# EAGLE design v1 (EAGLE 7.2.0)
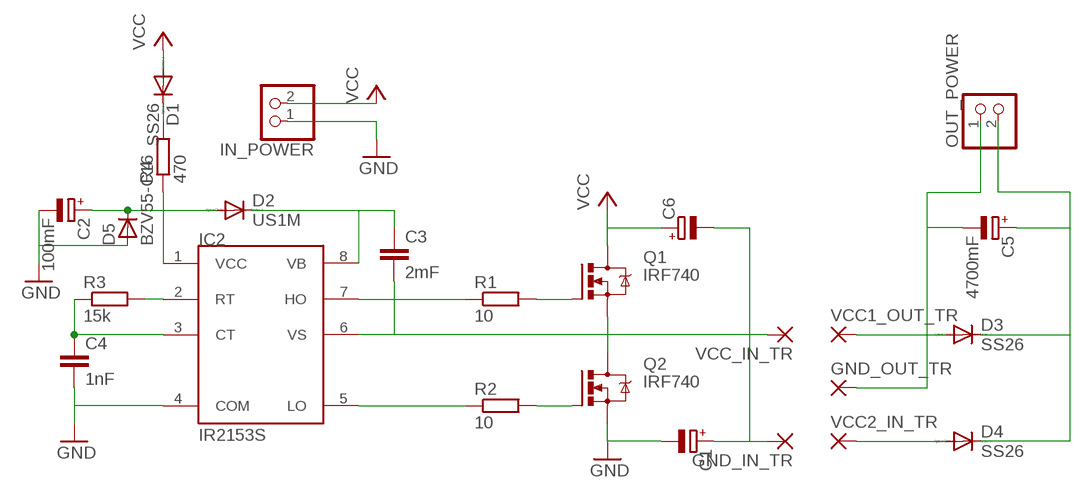
[diagram p0: schematic, sheet 1]

## Parts
C1  CPOL-EUE10-22.5  [EB22,5D]
C2  100mF  CPOL-EUC  [PANASONIC_C]
C3  2mF  C-EUC0805  [C0805]
C4  1nF  C-EUC0805  [C0805]
C5  4700mF  CPOL-EUE7.5-18  [E7,5-18]
C6  CPOL-EUE10-22.5  [EB22,5D]
D1  SS26  DIODE-DO-214AC  [DO-214AC]
D2  US1M  DIODE-DO-214AC  [DO-214AC]
D3  SS26  DIODE-DO-214AC  [DO-214AC]
D4  SS26  DIODE-DO-214AC  [DO-214AC]
D5  BZV55-C16  D-SOD-80  [SOD80]
GND_IN_TR  1,6/0,8  [1,6/0,8]
GND_OUT_TR  1,6/0,8  [1,6/0,8]
IC2  IR2153S  [SO08]
IN_POWER  PINHD-1X2  [1X02]
OUT_POWER  PINHD-1X2  [1X02]
Q1  IRF740  [TO220BV]
Q2  IRF740  [TO220BV]
R1  10  R-EU_R0805  [R0805]
R2  10  R-EU_R0805  [R0805]
R3  15k  R-EU_R0805  [R0805]
R4  470  R-EU_R0805  [R0805]
VCC1_OUT_TR  1,6/0,8  [1,6/0,8]
VCC2_IN_TR  1,6/0,8  [1,6/0,8]
VCC_IN_TR  1,6/0,8  [1,6/0,8]

## Nets
GND: C1.- C2.- C4.2 D5.2(A) IC2.4(COM) IN_POWER.1 Q2.S
N$1: IC2.7(HO) R1.1
N$2: IC2.5(LO) R2.1
N$3: C1.+ C6.- GND_IN_TR.1(P)
N$4: Q1.G R1.2
N$5: Q2.G R2.2
N$6: D3.A VCC1_OUT_TR.1(P)
N$7: IC2.2(RT) R3.2
N$8: C4.1 IC2.3(CT) R3.1
N$9: D4.A VCC2_IN_TR.1(P)
N$10: C5.- GND_OUT_TR.1(P) OUT_POWER.1
N$11: C5.+ D3.C D4.C OUT_POWER.2
N$12: D1.C R4.2
VB: C3.1 D2.C IC2.8(VB)
VCC: C6.+ D1.A IN_POWER.2 Q1.D
VCC_IR: C2.+ D2.A D5.1(C) IC2.1(VCC) R4.1
VS: C3.2 IC2.6(VS) Q1.S Q2.D VCC_IN_TR.1(P)

## Library data of the parts
C1 C2 C5 C6 = rcl:CPOL-EU: POLARIZED CAPACITOR, European symbol
C3 C4 = rcl:C-EU: CAPACITOR, European symbol
D1-D4 = diode:DIODE-: DIODE
D5 = semicon-smd-ipc:D-: DIODE unfilled
GND_IN_TR GND_OUT_TR VCC1_OUT_TR VCC2_IN_TR VCC_IN_TR = wirepad:1,6/0,8: THROUGH-HOLE PAD
IC2 = irs:IR2153
IN_POWER OUT_POWER = pinhead:PINHD-1X2: PIN HEADER
Q1 Q2 = transistor-power:IRF740: N-CHANNEL MOS FET
R1-R4 = rcl:R-EU_: RESISTOR, European symbol

## Board
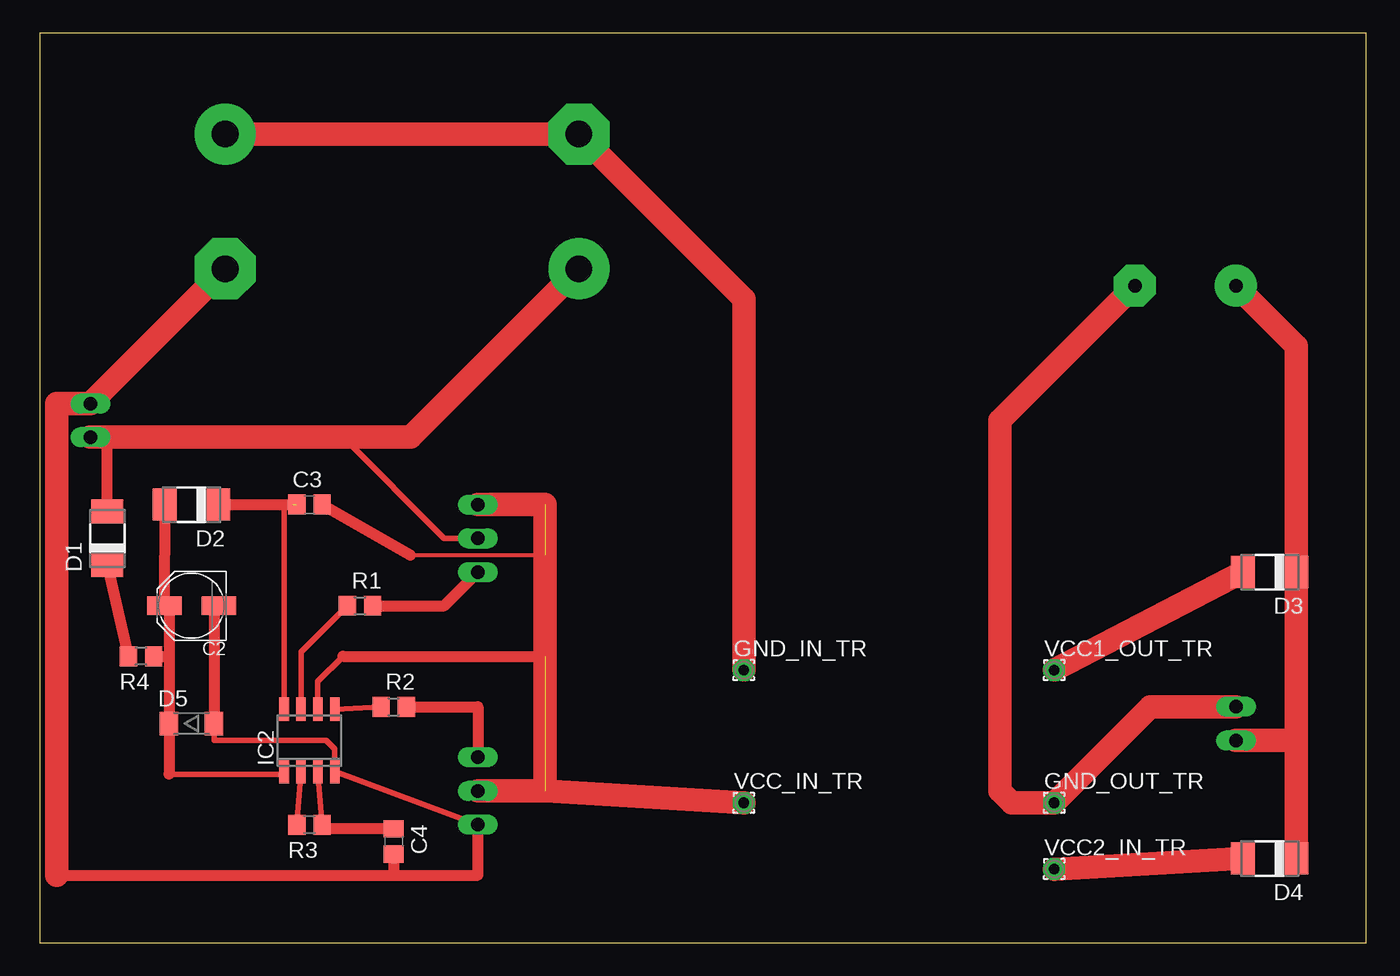
[diagram p1: board, top side]
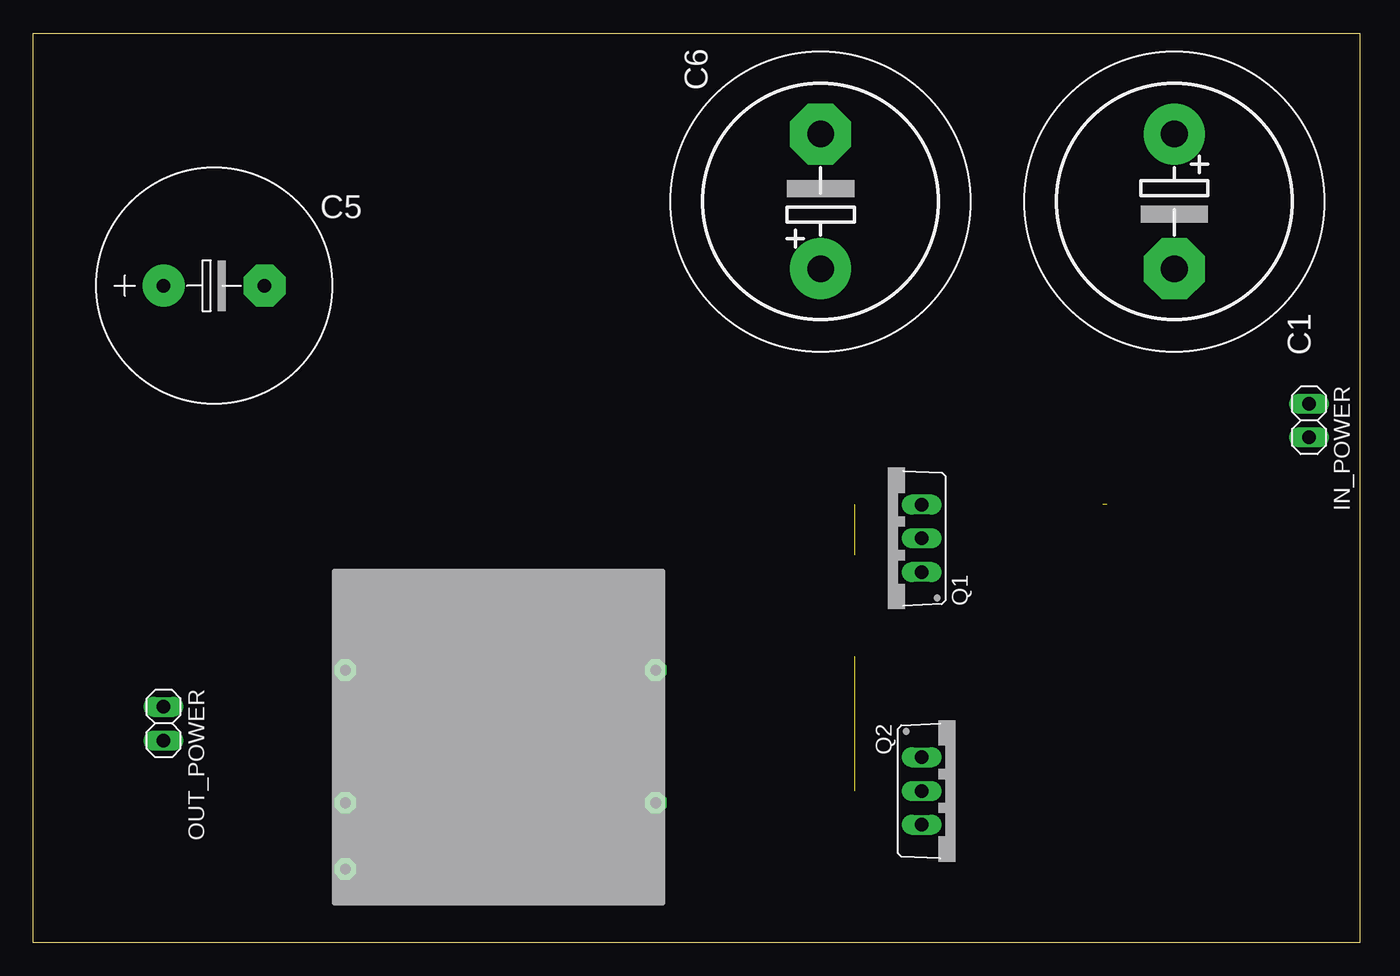
[diagram p2: board, bottom side, seen from below]

Size 100 x 68.57 mm. Coordinates in mm from the lower left corner, seen from the top.
Outline: 0,0 100,0 100,68.57 0,68.57 0,0
Copper layers (1*16): Top 0.035mm / dielectric 1.5mm / Bottom 0.035mm
Design rules "default": minimum track width 10mil, minimum drill 24mil, track to track 8mil, track to pad 8mil, pad to pad 8mil, via to via 8mil, smd to smd 8mil, copper to edge 40mil, drill to drill 8mil, minimum pad ring 10mil, minimum via ring 8mil, stop-mask expansion 4mil, vias tented up to drill 0mil, thermal gap 10mil

### Footprints (pad centres in the part's own frame; a part is rotated, then mirrored left to right if it is on the bottom)
EB22,5D = drill 2.007 pad 4.597: + -5.08,0 | drill 2.007 pad 4.597 octagon: - 5.08,0
PANASONIC_C = smd 2.6 x 1.4: + 2.05,0; - -2.05,0
C0805 = smd 1.3 x 1.5: 1 -0.95,0; 2 0.95,0
E7,5-18 = drill 1.016 pad 3.15: + -3.81,0 | drill 1.016 pad 3.15 octagon: - 3.81,0
DO-214AC = smd 1.8 x 2.4: A 2.025,0; C -2.025,0
SOD80 = smd 1.4 x 1.8: 1 -1.7,0; 2 1.7,0
1,6/0,8 = drill 0.813 pad 1.6 octagon: 1 0,0
SO08 = smd 0.72 x 1.78: 1 -1.905,-2.35; 2 -0.635,-2.35; 3 0.635,-2.35; 4 1.905,-2.35; 5 1.905,2.35; 6 0.635,2.35; 7 -0.635,2.35; 8 -1.905,2.35
1X02 = drill 1.016 long: 1 -1.27,0; 2 1.27,0
TO220BV = drill 1.016 long: D 0,-2.54; G -2.54,-2.54; S 2.54,-2.54
R0805 = smd 1.3 x 1.5: 1 -0.95,0; 2 0.95,0

### Placement (x,y rotation side)
C1  13.97,55.88 270 bottom
C2  11.43,25.4 180 top
C3  20.32,33.02 0 top
C4  26.67,7.62 270 top
C5  86.36,49.53 0 bottom
C6  40.64,55.88 90 bottom
D1  5.08,30.48 90 top
D2  11.43,33.02 180 top
D3  92.71,27.94 180 top
D4  92.71,6.35 180 top
D5  11.43,16.51 0 top
GND_IN_TR  53.07,20.54 0 top
GND_OUT_TR  76.47,10.54 0 top
IC2  20.32,15.24 0 top
IN_POWER  3.81,39.37 270 bottom
OUT_POWER  90.17,16.51 270 bottom
Q1  35.56,30.48 90 bottom
Q2  30.48,11.43 270 bottom
R1  24.13,25.4 0 top
R2  26.67,17.78 0 top
R3  20.32,8.89 180 top
R4  7.62,21.59 180 top
VCC1_OUT_TR  76.47,20.54 0 top
VCC2_IN_TR  76.47,5.54 0 top
VCC_IN_TR  53.07,10.54 0 top

### Tracks (layer width: path | path; a pad name or v marks a point on that pad's centre or on a via)
GND
  Top 0.406: C2.- 13.13,25.4 | D5.2 13.13,15.24 21.59,15.24 22.23,14.61 IC2.4 Q2.S
  Top 0.813: 13.13,25.4 D5.2 | 1.27,5.08 26.67,5.08 | 26.67,5.08 33.02,5.08 Q2.S | C4.2 26.67,5.08
  Top 1.778: C1.- IN_POWER.1 1.27,40.64 1.27,5.08
N$1
  Top 0.406: IC2.7 19.68,21.91 R1.1
N$2
  Top 0.406: IC2.5 R2.1
N$3
  Top 1.778: C1.+ C6.- 53.07,48.53 GND_IN_TR.1
N$4
  Top 0.813: R1.2 30.48,25.4 Q1.G
N$5
  Top 0.813: R2.2 33.02,17.78 Q2.G
N$6
  Top 1.778: VCC1_OUT_TR.1 D3.A
N$7
  Top 0.254: 19.43,12.57 19.66,12.8 IC2.2
  Top 0.406: R3.2 IC2.2
N$8
  Top 0.254: 21.03,12.8 IC2.3
  Top 0.406: 21.03,12.81 IC2.3 R3.1
  Top 0.813: C4.1 21.27,8.57 R3.1
N$9
  Top 1.778: VCC2_IN_TR.1 D4.A
N$10
  Top 1.778: OUT_POWER.1 83.71,17.78 GND_OUT_TR.1 73.28,10.54 72.39,11.43 72.39,39.37 C5.-
N$11
  Top 1.778: D4.C 94.73,15.24 | OUT_POWER.2 94.73,15.24 | 94.73,15.24 D3.C 94.73,44.97 C5.+
N$12
  Top 0.813: D1.C R4.2
VB  (1 unrouted)
  Top 0.406: IC2.8 18.41,33.02 19.05,33.02
  Top 0.813: D2.C 19.05,33.02 C3.1
VCC
  Top 0.406: Q1.D 30.48,30.48 22.86,38.1
  Top 0.813: D1.A 5.08,38.1
  Top 1.778: C6.+ 27.94,38.1 22.86,38.1 5.08,38.1 IN_POWER.2
VCC_IR
  Top 0.406: 9.73,25.05 C2.+ 9.4,25.43 | IC2.1 18.41,12.7 9.73,12.7
  Top 0.813: 9.73,25.05 9.73,21.59 | 9.73,21.59 D5.1 9.73,12.7 | R4.1 9.73,21.59 | D2.A C2.+
VS  (2 unrouted)
  Top 0.305: 27.94,29.21 38.1,29.21
  Top 0.406: IC2.6 20.95,19.68 22.86,21.59
  Top 0.813: 22.86,21.59 38.1,21.59 | C3.2 27.94,29.21
  Top 1.778: Q1.S 38.1,33.02 38.1,21.59 38.1,11.43 | 38.1,11.43 Q2.D | VCC_IN_TR.1 38.1,11.43